# Altium project nanopi_m1.PrjPcb
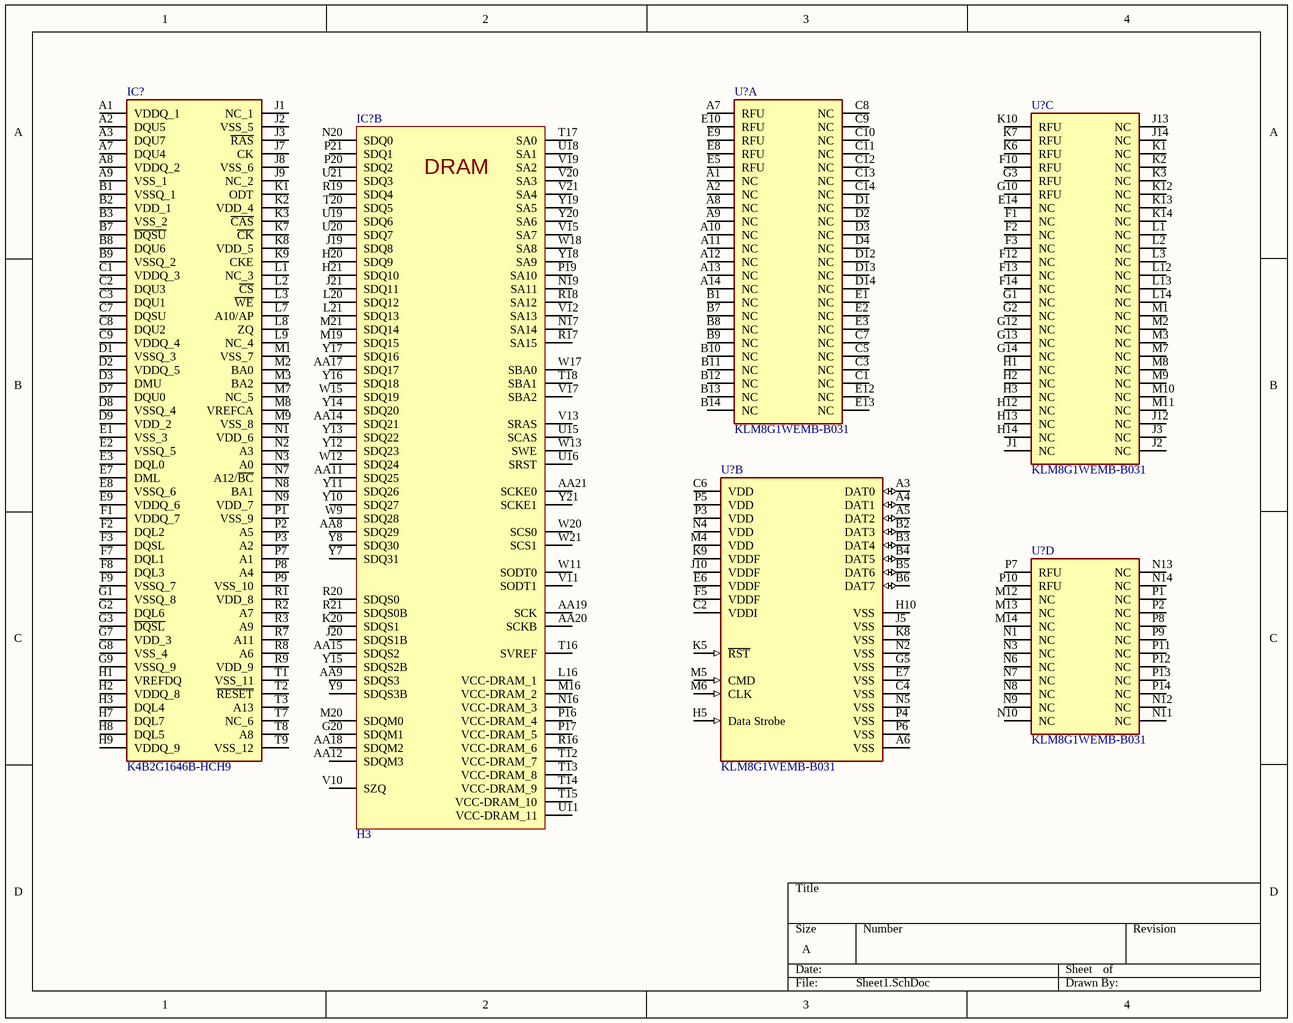
[diagram p0: Sheet1.SchDoc]
1 sheet, 6 parts. Net scope: global (net labels, ports and power ports of the same name join across sheets).

## Sheet Sheet1.SchDoc
size A; SheetNumber: 1; SheetTotal: 1

### Parts
(Parts that share a designator on the sheet are numbered #1, #2 ... from top to bottom, then left to right.)
IC?#1  K4B2G1646B-HCH9  [BGA96C80P9X16_900X1330X120]
IC?#2  H3  [BGA347C65P21X21_1400X1400X118]  (part B of 16)
U?#1  KLM8G1WEMB-B031  [FP-KLM8G1WEMB-B031-IPC_C]  (part A of 4)
U?#2  KLM8G1WEMB-B031  [FP-KLM8G1WEMB-B031-IPC_C]  (part C of 4)
U?#3  KLM8G1WEMB-B031  [FP-KLM8G1WEMB-B031-IPC_C]  (part B of 4)
U?#4  KLM8G1WEMB-B031  [FP-KLM8G1WEMB-B031-IPC_C]  (part D of 4)

### Nets

Not connected (* = marked no-connect by the designer): IC?#1 A1(VDDQ_1) A2(DQU5) A3(DQU7) A7(DQU4) A8(VDDQ_2) A9(VSS_1) B1(VSSQ_1) B2(VDD_1) B3(VSS_2) B7(~{DQSU}) B8(DQU6) B9(VSSQ_2) C1(VDDQ_3) C2(DQU3) C3(DQU1) C7(DQSU) C8(DQU2) C9(VDDQ_4) D1(VSSQ_3) D2(VDDQ_5) D3(DMU) D7(DQU0) D8(VSSQ_4) D9(VDD_2) E1(VSS_3) E2(VSSQ_5) E3(DQL0) E7(DML) E8(VSSQ_6) E9(VDDQ_6) F1(VDDQ_7) F2(DQL2) F3(DQSL) F7(DQL1) F8(DQL3) F9(VSSQ_7) G1(VSSQ_8) G2(DQL6) G3(~{DQSL}) G7(VDD_3) G8(VSS_4) G9(VSSQ_9) H1(VREFDQ) H2(VDDQ_8) H3(DQL4) H7(DQL7) H8(DQL5) H9(VDDQ_9) J1(NC_1) J2(VSS_5) J3(~{RAS}) J7(CK) J8(VSS_6) J9(NC_2) K1(ODT) K2(VDD_4) K3(~{CAS}) K7(~{CK}) K8(VDD_5) K9(CKE) L1(NC_3) L2(~{CS}) L3(~{WE}) L7(A10/AP) L8(ZQ) L9(NC_4) M1(VSS_7) M2(BA0) M3(BA2) M7(NC_5) M8(VREFCA) M9(VSS_8) N1(VDD_6) N2(A3) N3(A0) N7(A12/~{BC}) N8(BA1) N9(VDD_7) P1(VSS_9) P2(A5) P3(A2) P7(A1) P8(A4) P9(VSS_10) R1(VDD_8) R2(A7) R3(A9) R7(A11) R8(A6) R9(VDD_9) T1(VSS_11) T2(~{RESET}) T3(A13) T7(NC_6) T8(A8) T9(VSS_12); IC?#2 AA8(SDQ29) AA9(SDQS3) AA11(SDQ25) AA12(SDQM3) AA14(SDQ21) AA15(SDQS2) AA17(SDQ17) AA18(SDQM2) AA19(SCK) AA20(SCKB) AA21(SCKE0) G20(SDQM1) H20(SDQ9) H21(SDQ10) J19(SDQ8) J20(SDQS1B) J21(SDQ11) K20(SDQS1) L16(VCC-DRAM_1) L20(SDQ12) L21(SDQ13) M16(VCC-DRAM_2) M19(SDQ15) M20(SDQM0) M21(SDQ14) N16(VCC-DRAM_3) N17(SA14) N19(SA11) N20(SDQ0) P16(VCC-DRAM_4) P17(VCC-DRAM_5) P19(SA10) P20(SDQ2) P21(SDQ1) R16(VCC-DRAM_6) R17(SA15) R18(SA12) R19(SDQ4) R20(SDQS0) R21(SDQS0B) T12(VCC-DRAM_7) T13(VCC-DRAM_8) T14(VCC-DRAM_9) T15(VCC-DRAM_10) T16(SVREF) T17(SA0) T18(SBA1) T20(SDQ5) U11(VCC-DRAM_11) U15(SCAS) U16(SRST) U18(SA1) U19(SDQ6) U20(SDQ7) U21(SDQ3) V10(SZQ) V11(SODT1) V12(SA13) V13(SRAS) V15(SA7) V17(SBA2) V19(SA2) V20(SA3) V21(SA4) W9(SDQ28) W11(SODT0) W12(SDQ24) W13(SWE) W15(SDQ19) W17(SBA0) W18(SA8) W20(SCS0) W21(SCS1) Y7(SDQ31) Y8(SDQ30) Y9(SDQS3B) Y10(SDQ27) Y11(SDQ26) Y12(SDQ23) Y13(SDQ22) Y14(SDQ20) Y15(SDQS2B) Y16(SDQ18) Y17(SDQ16) Y18(SA9) Y19(SA5) Y20(SA6) Y21(SCKE1); U?#1 A1(NC) A2(NC) A7(RFU) A8(NC) A9(NC) A10(NC) A11(NC) A12(NC) A13(NC) A14(NC) B1(NC) B7(NC) B8(NC) B9(NC) B10(NC) B11(NC) B12(NC) B13(NC) B14(NC) C1(NC) C3(NC) C5(NC) C7(NC) C8(NC) C9(NC) C10(NC) C11(NC) C12(NC) C13(NC) C14(NC) D1(NC) D2(NC) D3(NC) D4(NC) D12(NC) D13(NC) D14(NC) E1(NC) E2(NC) E3(NC) E5(RFU) E8(RFU) E9(RFU) E10(RFU) E12(NC) E13(NC); U?#2 E14(NC) F1(NC) F2(NC) F3(NC) F10(RFU) F12(NC) F13(NC) F14(NC) G1(NC) G2(NC) G3(RFU) G10(RFU) G12(NC) G13(NC) G14(NC) H1(NC) H2(NC) H3(NC) H12(NC) H13(NC) H14(NC) J1(NC) J2(NC) J3(NC) J12(NC) J13(NC) J14(NC) K1(NC) K2(NC) K3(NC) K6(RFU) K7(RFU) K10(RFU) K12(NC) K13(NC) K14(NC) L1(NC) L2(NC) L3(NC) L12(NC) L13(NC) L14(NC) M1(NC) M2(NC) M3(NC) M7(NC) M8(NC) M9(NC) M10(NC) M11(NC); U?#3 A3(DAT0) A4(DAT1) A5(DAT2) A6(VSS) B2(DAT3) B3(DAT4) B4(DAT5) B5(DAT6) B6(DAT7) C2(VDDI) C4(VSS) C6(VDD) E6(VDDF) E7(VSS) F5(VDDF) G5(VSS) H5(Data_Strobe) H10(VSS) J5(VSS) J10(VDDF) K5(~{RST}) K8(VSS) K9(VDDF) M4(VDD) M5(CMD) M6(CLK) N2(VSS) N4(VDD) N5(VSS) P3(VDD) P4(VSS) P5(VDD) P6(VSS); U?#4 M12(NC) M13(NC) M14(NC) N1(NC) N3(NC) N6(NC) N7(NC) N8(NC) N9(NC) N10(NC) N11(NC) N12(NC) N13(NC) N14(NC) P1(NC) P2(NC) P7(RFU) P8(NC) P9(NC) P10(RFU) P11(NC) P12(NC) P13(NC) P14(NC)

### Notes on the sheet
- (in symbol H3, part B) DRAM

### Library data of the parts
IC?#1 = K4B2G1646B-HCH9: Integrated Circuit; Manufacturer_Name: SAMSUNG; Datasheet Link: https://datasheet.ciiva.com/26786/k4b2g1646b-hch9-26786971.pdf; Height: 1.2mm; Manufacturer_Part_Number: K4B2G1646B-HCH9
IC?#2 = H3: Integrated Circuit; Manufacturer_Name: Allwinner Technology; Datasheet Link: https://wiki.friendlyelec.com/wiki/images/4/4b/Allwinner_H3_Datasheet_V1.2.pdf; Height: 1.18mm; Manufacturer_Part_Number: H3
U?#1-U?#4 = CMP-13350-000002-1: MEMORY NAND FLASH 8Gb KLM8G1WEMB-B031 SAMSUNG; Memory Size: 8GBytes; Max Supply Voltage: 3.6V; Standoff Height: 0.17mm; Min Supply Voltage: 1.7V; Frequency: 200MHz; Nominal Supply Current: 80mA; Ipc Land Pattern Name: BGA196N50P14X14_1300X1150X70; Package: 0; Memory Type: FLASH; Automotive: No; ComponentLink2Description: Datasheet; Device Class L3: Flash; Temperature Range Low: -25°C; Manufacturer Part Number: KLM8G1WEMB-B031; Temperature: -25°C to +85°C; Device Class L1: Integrated Circuits (ICs); Manufacturer: Samsung; RoHS: TRUE; Height: 0.8mm; Category: IC; Temperature Range High: +85°C; Lead Free: Yes; ComponentLink2URL: https://datasheetspdf.com/pdf-file/934416/Samsung/KLM8G1WEMB-B031/1; Device Class L2: Memory; Octopart: https://octopart.com/klm8g1wemb-b031-samsung-39191586